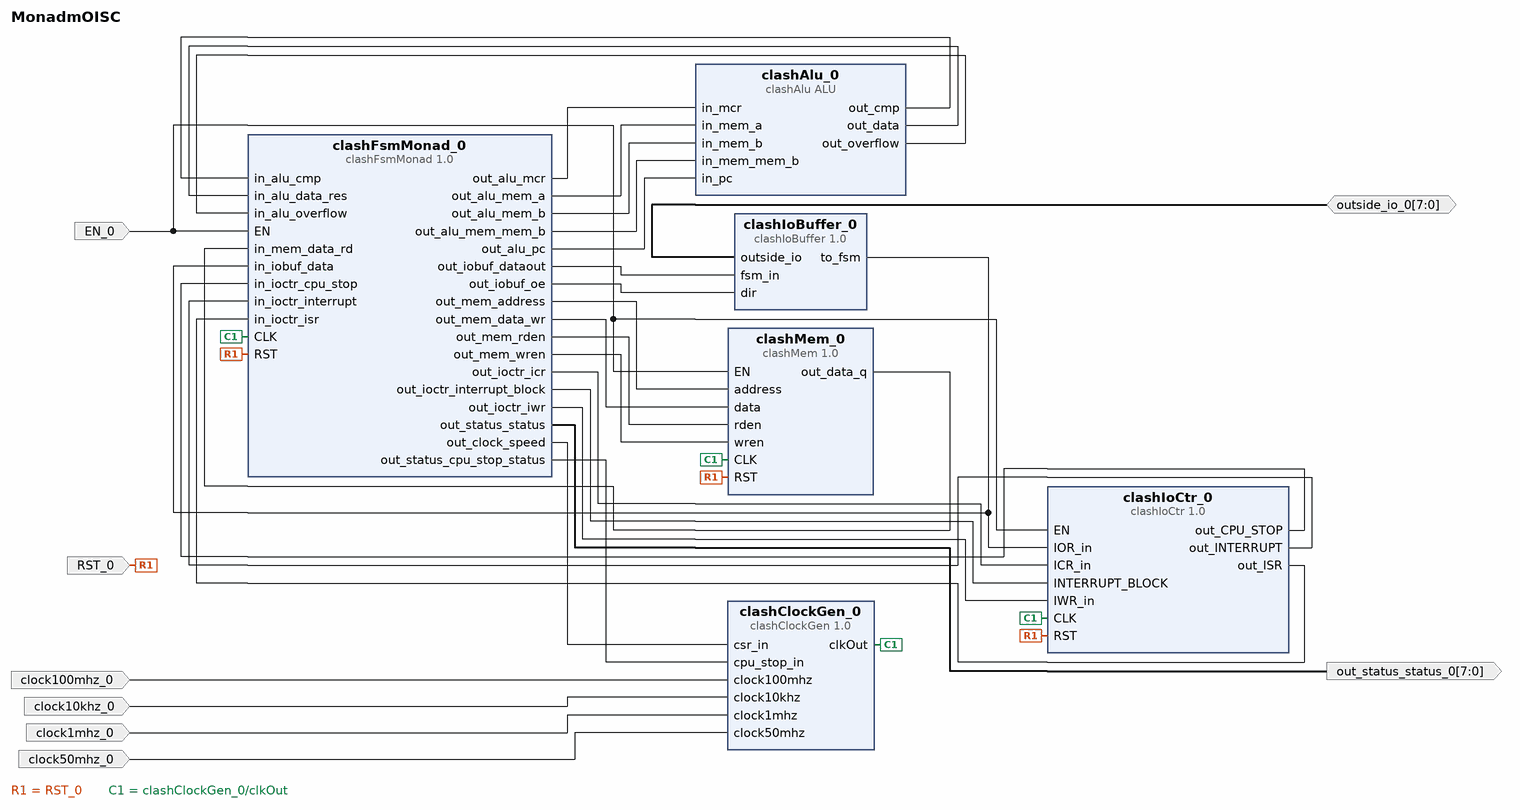
[diagram p0: block diagram of the top level]
# Vivado block design MonadmOISC, xc7z020clg400-1, Vivado 2021.2.1
create_bd_design MonadmOISC

create_bd_port -dir IO -from 7 -to 0 outside_io_0
create_bd_port -dir I clock10khz_0
create_bd_port -dir I clock1mhz_0
create_bd_port -dir I clock50mhz_0
create_bd_port -dir I clock100mhz_0
create_bd_port -dir I -type rst RST_0
create_bd_port -dir I EN_0
create_bd_port -dir O -from 7 -to 0 out_status_status_0

create_bd_cell -type ip -vlnv cs12.tf.fau.de:mOISCclash:clashFsmMonad:1.0 clashFsmMonad_0
create_bd_cell -type ip -vlnv cs12.tf.fau.de:mOISCclash:clashMem:1.0 clashMem_0
set_property -dict [list \
  CONFIG.memory_file D:/git/clash-moisc/Vivado/MoiscBlocksMonad/MoiscBlocksMonad.srcs/sources_1/imports/mem/iotest2.clash.bin \
] [get_bd_cells clashMem_0]
create_bd_cell -type ip -vlnv cs12.tf.fau.de:mOISCclash:clashAlu:ALU:1.0 clashAlu_0
create_bd_cell -type ip -vlnv cs12.tf.fau.de:mOISCclash:clashClockGen:1.0 clashClockGen_0
create_bd_cell -type ip -vlnv cs12.tf.fau.de:mOISCclash:clashIoBuffer:1.0 clashIoBuffer_0
create_bd_cell -type ip -vlnv cs12.tf.fau.de:mOISCclash:clashIoCtr:1.0 clashIoCtr_0

# ---- connections ----

connect_bd_net -net EN_0_1 [get_bd_ports EN_0] [get_bd_pins clashFsmMonad_0/EN] [get_bd_pins clashMem_0/EN] [get_bd_pins clashIoCtr_0/EN]
connect_bd_net [get_bd_ports outside_io_0] [get_bd_pins clashIoBuffer_0/outside_io]
connect_bd_net -net RST_0_1 [get_bd_ports RST_0] [get_bd_pins clashFsmMonad_0/RST] [get_bd_pins clashMem_0/RST] [get_bd_pins clashIoCtr_0/RST]
connect_bd_net [get_bd_pins clashAlu_0/out_cmp] [get_bd_pins clashFsmMonad_0/in_alu_cmp]
connect_bd_net [get_bd_pins clashAlu_0/out_data] [get_bd_pins clashFsmMonad_0/in_alu_data_res]
connect_bd_net [get_bd_pins clashAlu_0/out_overflow] [get_bd_pins clashFsmMonad_0/in_alu_overflow]
connect_bd_net [get_bd_pins clashClockGen_0/clkOut] [get_bd_pins clashFsmMonad_0/CLK] [get_bd_pins clashMem_0/CLK] [get_bd_pins clashIoCtr_0/CLK]
connect_bd_net [get_bd_pins clashFsmMonad_0/out_alu_mcr] [get_bd_pins clashAlu_0/in_mcr]
connect_bd_net [get_bd_pins clashFsmMonad_0/out_alu_mem_a] [get_bd_pins clashAlu_0/in_mem_a]
connect_bd_net [get_bd_pins clashFsmMonad_0/out_alu_mem_b] [get_bd_pins clashAlu_0/in_mem_b]
connect_bd_net [get_bd_pins clashFsmMonad_0/out_alu_mem_mem_b] [get_bd_pins clashAlu_0/in_mem_mem_b]
connect_bd_net [get_bd_pins clashFsmMonad_0/out_alu_pc] [get_bd_pins clashAlu_0/in_pc]
connect_bd_net [get_bd_pins clashFsmMonad_0/out_clock_speed] [get_bd_pins clashClockGen_0/csr_in]
connect_bd_net [get_bd_pins clashFsmMonad_0/out_iobuf_dataout] [get_bd_pins clashIoBuffer_0/fsm_in]
connect_bd_net [get_bd_pins clashFsmMonad_0/out_iobuf_oe] [get_bd_pins clashIoBuffer_0/dir]
connect_bd_net [get_bd_pins clashFsmMonad_0/out_ioctr_icr] [get_bd_pins clashIoCtr_0/ICR_in]
connect_bd_net [get_bd_pins clashFsmMonad_0/out_ioctr_interrupt_block] [get_bd_pins clashIoCtr_0/INTERRUPT_BLOCK]
connect_bd_net [get_bd_pins clashFsmMonad_0/out_ioctr_iwr] [get_bd_pins clashIoCtr_0/IWR_in]
connect_bd_net [get_bd_pins clashFsmMonad_0/out_mem_address] [get_bd_pins clashMem_0/address]
connect_bd_net [get_bd_pins clashFsmMonad_0/out_mem_data_wr] [get_bd_pins clashMem_0/data]
connect_bd_net [get_bd_pins clashFsmMonad_0/out_mem_rden] [get_bd_pins clashMem_0/rden]
connect_bd_net [get_bd_pins clashFsmMonad_0/out_mem_wren] [get_bd_pins clashMem_0/wren]
connect_bd_net [get_bd_pins clashFsmMonad_0/out_status_cpu_stop_status] [get_bd_pins clashClockGen_0/cpu_stop_in]
connect_bd_net [get_bd_pins clashFsmMonad_0/out_status_status] [get_bd_ports out_status_status_0]
connect_bd_net [get_bd_pins clashIoBuffer_0/to_fsm] [get_bd_pins clashIoCtr_0/IOR_in] [get_bd_pins clashFsmMonad_0/in_iobuf_data]
connect_bd_net [get_bd_pins clashIoCtr_0/out_CPU_STOP] [get_bd_pins clashFsmMonad_0/in_ioctr_cpu_stop]
connect_bd_net [get_bd_pins clashIoCtr_0/out_INTERRUPT] [get_bd_pins clashFsmMonad_0/in_ioctr_interrupt]
connect_bd_net [get_bd_pins clashIoCtr_0/out_ISR] [get_bd_pins clashFsmMonad_0/in_ioctr_isr]
connect_bd_net [get_bd_pins clashMem_0/out_data_q] [get_bd_pins clashFsmMonad_0/in_mem_data_rd]
connect_bd_net -net clock100mhz_0_1 [get_bd_ports clock100mhz_0] [get_bd_pins clashClockGen_0/clock100mhz]
connect_bd_net -net clock10khz_0_1 [get_bd_ports clock10khz_0] [get_bd_pins clashClockGen_0/clock10khz]
connect_bd_net -net clock1mhz_0_1 [get_bd_ports clock1mhz_0] [get_bd_pins clashClockGen_0/clock1mhz]
connect_bd_net -net clock50mhz_0_1 [get_bd_ports clock50mhz_0] [get_bd_pins clashClockGen_0/clock50mhz]

validate_bd_design
save_bd_design
